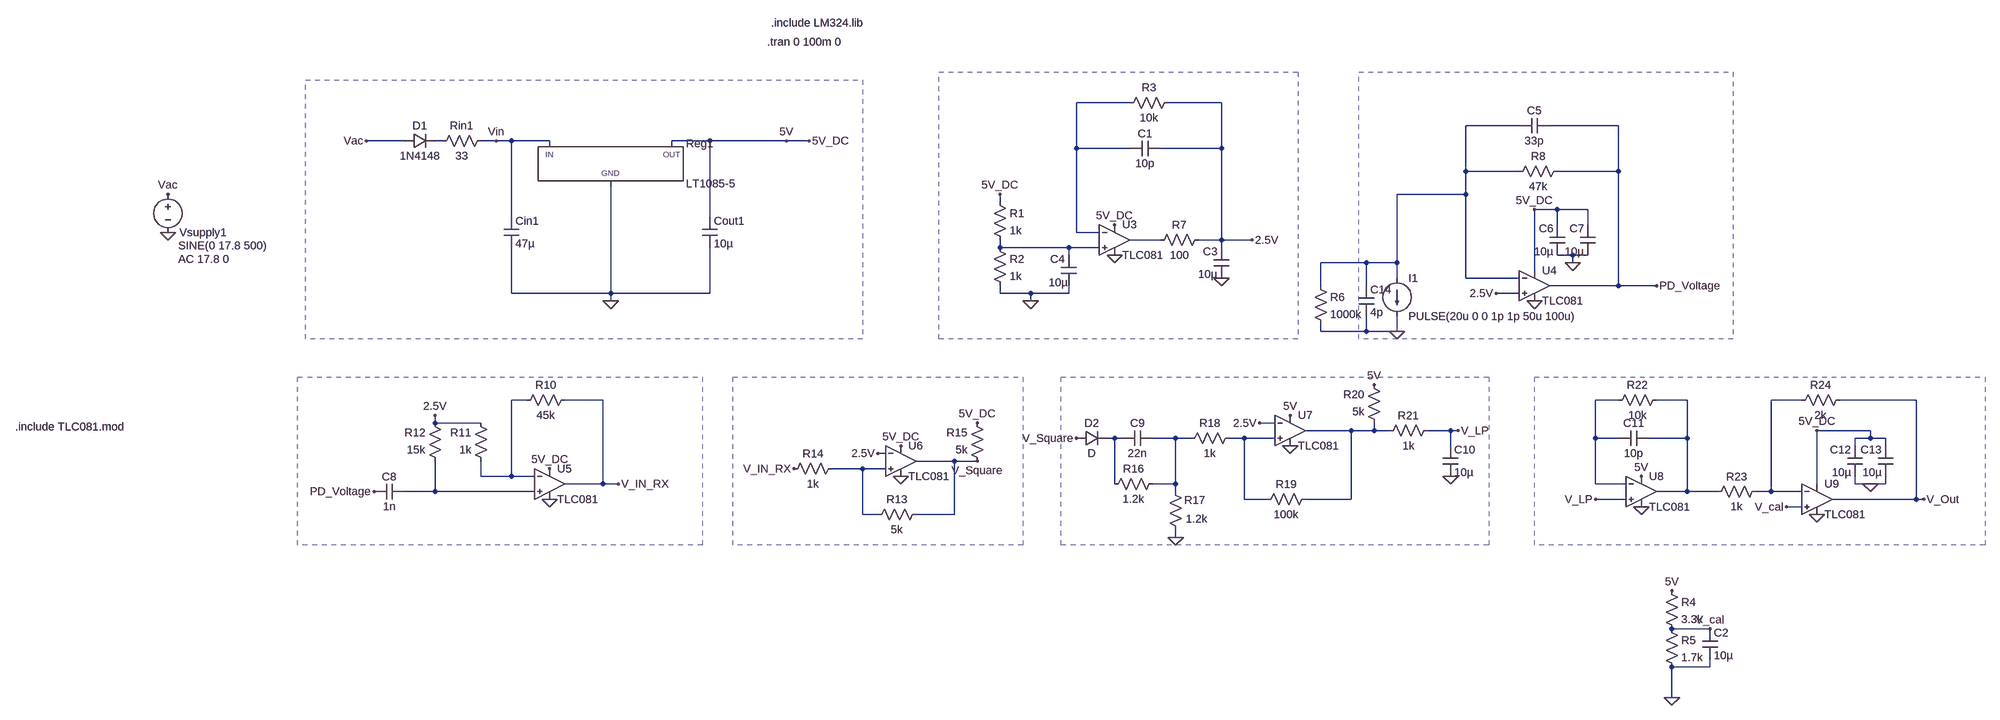
[diagram p0: schematic 310_Phase3.asc]
310_Phase3.asc, the LTspice schematic file:
Version 4
SHEET 1 2424 916
WIRE 240 -352 128 -352
WIRE 432 -352 320 -352
WIRE 1056 -304 944 -304
WIRE 1264 -304 1120 -304
WIRE -1280 -272 -1360 -272
WIRE -1200 -272 -1216 -272
WIRE -1088 -272 -1120 -272
WIRE -1056 -272 -1088 -272
WIRE -976 -272 -1056 -272
WIRE -640 -272 -720 -272
WIRE -480 -272 -640 -272
WIRE -432 -272 -480 -272
WIRE 128 -256 128 -352
WIRE 240 -256 128 -256
WIRE 432 -256 432 -352
WIRE 432 -256 304 -256
WIRE 944 -208 944 -304
WIRE 1056 -208 944 -208
WIRE 1264 -208 1264 -304
WIRE 1264 -208 1136 -208
WIRE 944 -160 944 -208
WIRE 944 -160 800 -160
WIRE -32 -144 -32 -160
WIRE 1136 -128 1088 -128
WIRE 1200 -128 1136 -128
WIRE -1056 -112 -1056 -272
WIRE -640 -112 -640 -272
WIRE 1136 -96 1136 -128
WIRE 1200 -96 1200 -128
WIRE 128 -80 128 -256
WIRE 176 -80 128 -80
WIRE 304 -64 240 -64
WIRE 432 -64 432 -256
WIRE 432 -64 384 -64
WIRE 496 -64 432 -64
WIRE -32 -48 -32 -64
WIRE 112 -48 -32 -48
WIRE 176 -48 112 -48
WIRE 432 -48 432 -64
WIRE 112 -32 112 -48
WIRE 1168 -32 1136 -32
WIRE 1200 -32 1168 -32
WIRE 736 -16 640 -16
WIRE 800 -16 800 -160
WIRE 800 -16 736 -16
WIRE 1168 -16 1168 -32
WIRE 1088 0 1088 -128
WIRE 800 16 800 -16
WIRE 944 16 944 -160
WIRE 1056 16 944 16
WIRE 640 32 640 -16
WIRE 736 32 736 -16
WIRE 1264 32 1264 -208
WIRE 1264 32 1120 32
WIRE 1344 32 1264 32
WIRE -1056 48 -1056 -48
WIRE -848 48 -848 -176
WIRE -848 48 -1056 48
WIRE -640 48 -640 -48
WIRE -640 48 -848 48
WIRE -32 48 -32 32
WIRE 32 48 -32 48
WIRE 112 48 112 32
WIRE 112 48 32 48
WIRE 1056 48 1008 48
WIRE -848 64 -848 48
WIRE 32 64 32 48
WIRE 640 128 640 112
WIRE 736 128 736 96
WIRE 736 128 640 128
WIRE 800 128 800 96
WIRE 800 128 736 128
WIRE -1024 272 -1056 272
WIRE -864 272 -944 272
WIRE 1264 272 1216 272
WIRE 1408 272 1344 272
WIRE 1648 272 1584 272
WIRE 1888 272 1728 272
WIRE -1216 320 -1216 304
WIRE -1120 320 -1216 320
WIRE 544 320 512 320
WIRE 704 336 608 336
WIRE 752 336 752 320
WIRE 752 336 704 336
WIRE 784 336 752 336
WIRE 912 336 864 336
WIRE 928 336 912 336
WIRE 1792 336 1680 336
WIRE 208 352 192 352
WIRE 224 352 208 352
WIRE 336 352 288 352
WIRE 368 352 336 352
WIRE 480 352 448 352
WIRE 544 352 480 352
WIRE 1216 352 1216 272
WIRE 1264 352 1216 352
WIRE 1408 352 1408 272
WIRE 1408 352 1328 352
WIRE 1792 352 1792 336
WIRE 1792 352 1760 352
WIRE 1824 352 1792 352
WIRE 912 368 912 336
WIRE 1760 368 1760 352
WIRE 1824 368 1824 352
WIRE -272 384 -288 384
WIRE -128 400 -208 400
WIRE -80 400 -128 400
WIRE -320 416 -384 416
WIRE -272 416 -320 416
WIRE -1120 432 -1120 400
WIRE -1056 432 -1056 272
WIRE -1056 432 -1120 432
WIRE -1008 432 -1056 432
WIRE -864 448 -864 272
WIRE -864 448 -944 448
WIRE -832 448 -864 448
WIRE 208 448 208 352
WIRE 336 448 336 352
WIRE 336 448 288 448
WIRE 1216 448 1216 352
WIRE 1280 448 1216 448
WIRE 1680 448 1680 336
WIRE 1760 448 1760 432
WIRE 1792 448 1760 448
WIRE 1824 448 1824 432
WIRE 1824 448 1792 448
WIRE -1216 464 -1216 400
WIRE -1216 464 -1280 464
WIRE -1008 464 -1216 464
WIRE 336 464 336 448
WIRE 1408 464 1408 352
WIRE 1408 464 1344 464
WIRE 1472 464 1408 464
WIRE 1584 464 1584 272
WIRE 1584 464 1552 464
WIRE 1648 464 1584 464
WIRE 480 480 480 352
WIRE 528 480 480 480
WIRE 704 480 704 336
WIRE 704 480 608 480
WIRE 1280 480 1216 480
WIRE 1888 480 1888 272
WIRE 1888 480 1712 480
WIRE 1904 480 1888 480
WIRE 1648 496 1616 496
WIRE -320 512 -320 416
WIRE -288 512 -320 512
WIRE -128 512 -128 400
WIRE -128 512 -208 512
WIRE 336 560 336 544
WIRE 1456 752 1376 752
WIRE 1456 832 1456 816
WIRE 1456 832 1376 832
WIRE 1376 896 1376 832
FLAG -1360 -272 Vac
FLAG -480 -272 5V
FLAG -1088 -272 Vin
FLAG -432 -272 5V_DC
FLAG -1776 -80 0
FLAG -1776 -160 Vac
FLAG 208 -96 5V_DC
FLAG 208 -32 0
FLAG 32 64 0
FLAG -32 -160 5V_DC
FLAG 496 -64 2.5V
FLAG 432 16 0
FLAG 1088 64 0
FLAG 1008 48 2.5V
FLAG 1344 32 PD_Voltage
FLAG 1168 -16 0
FLAG 1088 -128 5V_DC
FLAG -976 480 0
FLAG -976 416 5V_DC
FLAG -1216 304 2.5V
FLAG -1344 464 PD_Voltage
FLAG -832 448 V_IN_RX
FLAG -240 432 0
FLAG -240 368 5V_DC
FLAG -80 320 5V_DC
FLAG -464 416 V_IN_RX
FLAG -288 384 2.5V
FLAG 336 560 0
FLAG 912 432 0
FLAG 576 368 0
FLAG 576 304 5V
FLAG 752 240 5V
FLAG 512 320 2.5V
FLAG 1312 496 0
FLAG 1312 432 5V
FLAG 1680 512 0
FLAG 1680 336 5V_DC
FLAG 928 336 V_LP
FLAG 1216 480 V_LP
FLAG 1792 448 0
FLAG 1904 480 V_Out
FLAG 800 128 0
FLAG -848 64 0
FLAG -80 400 V_Square
FLAG 128 352 V_Square
FLAG 1616 496 V_cal
FLAG 1456 752 V_cal
FLAG 1376 896 0
FLAG 1376 672 5V
SYMBOL PowerProducts/LT1085-5 -848 -272 R0
SYMATTR InstName Reg1
SYMBOL res -1104 -288 R90
WINDOW 0 0 56 VBottom 2
WINDOW 3 32 56 VTop 2
SYMATTR InstName Rin1
SYMATTR Value 33
SYMBOL diode -1280 -256 R270
WINDOW 0 32 32 VTop 2
WINDOW 3 0 32 VBottom 2
SYMATTR InstName D1
SYMATTR Value 1N4148
SYMBOL cap -1072 -112 R0
SYMATTR InstName Cin1
SYMATTR Value 47µ
SYMATTR SpiceLine Rser=0.001
SYMBOL cap -656 -112 R0
SYMATTR InstName Cout1
SYMATTR Value 10µ
SYMATTR SpiceLine Rser=0.001
SYMBOL voltage -1776 -176 R0
WINDOW 0 24 96 Left 2
WINDOW 3 22 124 Left 2
WINDOW 123 22 152 Left 2
WINDOW 39 0 0 Left 0
SYMATTR InstName Vsupply1
SYMATTR Value SINE(0 17.8 500)
SYMATTR Value2 AC 17.8 0
SYMBOL OpAmps\\opamp2 208 -128 R0
SYMATTR InstName U3
SYMATTR Value TLC081
SYMBOL res -48 -160 R0
SYMATTR InstName R1
SYMATTR Value 1k
SYMBOL res -48 -64 R0
SYMATTR InstName R2
SYMATTR Value 1k
SYMBOL res 336 -368 R90
WINDOW 0 0 56 VBottom 2
WINDOW 3 32 56 VTop 2
SYMATTR InstName R3
SYMATTR Value 10k
SYMBOL res 400 -80 R90
WINDOW 0 0 56 VBottom 2
WINDOW 3 32 56 VTop 2
SYMATTR InstName R7
SYMATTR Value 100
SYMBOL cap 304 -272 R90
WINDOW 0 0 32 VBottom 2
WINDOW 3 32 32 VTop 2
SYMATTR InstName C1
SYMATTR Value 10p
SYMBOL cap 448 16 R180
WINDOW 0 24 56 Left 2
WINDOW 3 24 8 Left 2
SYMATTR InstName C3
SYMATTR Value 10µ
SYMBOL cap 128 32 R180
WINDOW 0 24 56 Left 2
WINDOW 3 18 7 Left 2
SYMATTR InstName C4
SYMATTR Value 10µ
SYMBOL OpAmps\\opamp2 1088 -32 R0
SYMATTR InstName U4
SYMATTR Value TLC081
SYMBOL res 1152 -224 R90
WINDOW 0 0 56 VBottom 2
WINDOW 3 32 56 VTop 2
SYMATTR InstName R8
SYMATTR Value 47k
SYMBOL cap 1120 -320 R90
WINDOW 0 0 32 VBottom 2
WINDOW 3 32 32 VTop 2
SYMATTR InstName C5
SYMATTR Value 33p
SYMBOL cap 1152 -32 R180
WINDOW 0 24 56 Left 2
WINDOW 3 24 8 Left 2
SYMATTR InstName C6
SYMATTR Value 10µ
SYMBOL cap 1216 -32 R180
WINDOW 0 24 56 Left 2
WINDOW 3 24 8 Left 2
SYMATTR InstName C7
SYMATTR Value 10µ
SYMBOL OpAmps\\opamp2 -976 384 R0
SYMATTR InstName U5
SYMATTR Value TLC081
SYMBOL res -928 256 R90
WINDOW 0 0 56 VBottom 2
WINDOW 3 32 56 VTop 2
SYMATTR InstName R10
SYMATTR Value 45k
SYMBOL res -1104 416 R180
WINDOW 0 36 76 Left 2
WINDOW 3 36 40 Left 2
SYMATTR InstName R11
SYMATTR Value 1k
SYMBOL res -1200 416 R180
WINDOW 0 36 76 Left 2
WINDOW 3 36 40 Left 2
SYMATTR InstName R12
SYMATTR Value 15k
SYMBOL cap -1280 448 R90
WINDOW 0 0 32 VBottom 2
WINDOW 3 32 32 VTop 2
SYMATTR InstName C8
SYMATTR Value 1n
SYMBOL OpAmps\\opamp2 -240 336 R0
SYMATTR InstName U6
SYMATTR Value TLC081
SYMBOL res -192 496 R90
WINDOW 0 0 56 VBottom 2
WINDOW 3 32 56 VTop 2
SYMATTR InstName R13
SYMATTR Value 5k
SYMBOL res -368 400 R90
WINDOW 0 0 56 VBottom 2
WINDOW 3 32 56 VTop 2
SYMATTR InstName R14
SYMATTR Value 1k
SYMBOL res -64 416 R180
WINDOW 0 36 76 Left 2
WINDOW 3 36 40 Left 2
SYMATTR InstName R15
SYMATTR Value 5k
SYMBOL diode 128 368 R270
WINDOW 0 32 32 VTop 2
WINDOW 3 0 32 VBottom 2
SYMATTR InstName D2
SYMBOL cap 288 336 R90
WINDOW 0 0 32 VBottom 2
WINDOW 3 32 32 VTop 2
SYMATTR InstName C9
SYMATTR Value 22n
SYMBOL res 304 432 R90
WINDOW 0 0 56 VBottom 2
WINDOW 3 32 56 VTop 2
SYMATTR InstName R16
SYMATTR Value 1.2k
SYMBOL res 352 560 R180
WINDOW 0 -46 78 Left 2
WINDOW 3 -51 39 Left 2
SYMATTR InstName R17
SYMATTR Value 1.2k
SYMBOL res 464 336 R90
WINDOW 0 0 56 VBottom 2
WINDOW 3 32 56 VTop 2
SYMATTR InstName R18
SYMATTR Value 1k
SYMBOL res 624 464 R90
WINDOW 0 0 56 VBottom 2
WINDOW 3 32 56 VTop 2
SYMATTR InstName R19
SYMATTR Value 100k
SYMBOL res 768 336 R180
WINDOW 0 36 76 Left 2
WINDOW 3 36 40 Left 2
SYMATTR InstName R20
SYMATTR Value 5k
SYMBOL cap 896 368 R0
SYMATTR InstName C10
SYMATTR Value 10µ
SYMBOL OpAmps\\opamp2 576 272 R0
SYMATTR InstName U7
SYMATTR Value TLC081
SYMBOL res 880 320 R90
WINDOW 0 0 56 VBottom 2
WINDOW 3 32 56 VTop 2
SYMATTR InstName R21
SYMATTR Value 1k
SYMBOL OpAmps\\opamp2 1312 400 R0
SYMATTR InstName U8
SYMATTR Value TLC081
SYMBOL OpAmps\\opamp2 1680 416 R0
SYMATTR InstName U9
SYMATTR Value TLC081
SYMBOL res 1360 256 R90
WINDOW 0 0 56 VBottom 2
WINDOW 3 32 56 VTop 2
SYMATTR InstName R22
SYMATTR Value 10k
SYMBOL res 1568 448 R90
WINDOW 0 0 56 VBottom 2
WINDOW 3 32 56 VTop 2
SYMATTR InstName R23
SYMATTR Value 1k
SYMBOL res 1744 256 R90
WINDOW 0 0 56 VBottom 2
WINDOW 3 32 56 VTop 2
SYMATTR InstName R24
SYMATTR Value 2k
SYMBOL cap 1328 336 R90
WINDOW 0 0 32 VBottom 2
WINDOW 3 32 32 VTop 2
SYMATTR InstName C11
SYMATTR Value 10p
SYMBOL cap 1776 432 R180
WINDOW 0 24 56 Left 2
WINDOW 3 24 8 Left 2
SYMATTR InstName C12
SYMATTR Value 10µ
SYMBOL cap 1840 432 R180
WINDOW 0 24 56 Left 2
WINDOW 3 24 8 Left 2
SYMATTR InstName C13
SYMATTR Value 10µ
SYMBOL current 800 16 R0
WINDOW 123 24 108 Left 2
WINDOW 39 0 0 Left 0
SYMATTR InstName I1
SYMATTR Value PULSE(20u 0 0 1p 1p 50u 100u)
SYMBOL res 1360 656 R0
SYMATTR InstName R4
SYMATTR Value 3.3k
SYMBOL res 1360 736 R0
SYMATTR InstName R5
SYMATTR Value 1.7k
SYMBOL cap 1440 752 R0
SYMATTR InstName C2
SYMATTR Value 10µ
SYMBOL cap 720 32 R0
SYMATTR InstName C14
SYMATTR Value 4p
SYMBOL res 624 16 R0
SYMATTR InstName R6
SYMATTR Value 1000k
TEXT -512 -520 Left 2 !.include LM324.lib
TEXT -520 -480 Left 2 !.tran 0 100m 0
TEXT -2096 328 Left 2 !.include TLC081.mod
RECTANGLE Normal -320 144 -1488 -400 2
RECTANGLE Normal 592 144 -160 -416 2
RECTANGLE Normal -656 576 -1504 224 2
RECTANGLE Normal 16 576 -592 224 2
RECTANGLE Normal 992 576 96 224 2
RECTANGLE Normal 1504 144 720 -416 2
RECTANGLE Normal 2032 576 1088 224 2

The netlist it stands for:
* 310_Phase3.asc
XReg1 0 5V_DC Vin LT1085-5  ; pins GND OUT IN
Rin1 Vin N003 33
D1 Vac N003 1N4148
Cin1 Vin 0 47µ Rser=0.001
Cout1 5V_DC 0 10µ Rser=0.001
Vsupply1 Vac 0 SINE(0 17.8 500) AC 17.8 0
XU3 N005 N001 5V_DC 0 N004 TLC081  ; pins In+ In- V+ V- OUT
R1 5V_DC N005 1k
R2 N005 0 1k
R3 2.5V N001 10k
R7 2.5V N004 100
C1 2.5V N001 10p
C3 0 2.5V 10µ
C4 0 N005 10µ
XU4 2.5V N002 5V_DC 0 PD_Voltage TLC081  ; pins In+ In- V+ V- OUT
R8 PD_Voltage N002 47k
C5 PD_Voltage N002 33p
C6 0 5V_DC 10µ
C7 0 5V_DC 10µ
XU5 N015 N006 5V_DC 0 V_IN_RX TLC081  ; pins In+ In- V+ V- OUT
R10 V_IN_RX N006 45k
R11 N006 2.5V 1k
R12 N015 2.5V 15k
C8 N015 PD_Voltage 1n
XU6 N014 2.5V 5V_DC 0 V_Square TLC081  ; pins In+ In- V+ V- OUT
R13 V_Square N014 5k
R14 N014 V_IN_RX 1k
R15 V_Square 5V_DC 5k
D2 V_Square N011 D
C9 N012 N011 22n
R16 N012 N011 1.2k
R17 0 N012 1.2k
R18 N013 N012 1k
R19 N010 N013 100k
R20 N010 5V_DC 5k
C10 V_LP 0 10µ
XU7 N013 2.5V 5V_DC 0 N010 TLC081  ; pins In+ In- V+ V- OUT
R21 V_LP N010 1k
XU8 V_LP N007 5V_DC 0 N008 TLC081  ; pins In+ In- V+ V- OUT
XU9 V_cal N009 5V_DC 0 V_Out TLC081  ; pins In+ In- V+ V- OUT
R22 N008 N007 10k
R23 N009 N008 1k
R24 V_Out N009 2k
C11 N008 N007 10p
C12 0 5V_DC 10µ
C13 0 5V_DC 10µ
I1 N002 0 PULSE(20u 0 0 1p 1p 50u 100u)
R4 5V_DC V_cal 3.3k
R5 V_cal 0 1.7k
C2 V_cal 0 10µ
C14 N002 0 4p
R6 N002 0 1000k
.model D D
.lib standard.dio
.include LM324.lib
.tran 0 100m 0
.include TLC081.mod
.backanno
.end